# Altium project PCB_design_manufacture_bag_tag.PrjPcb
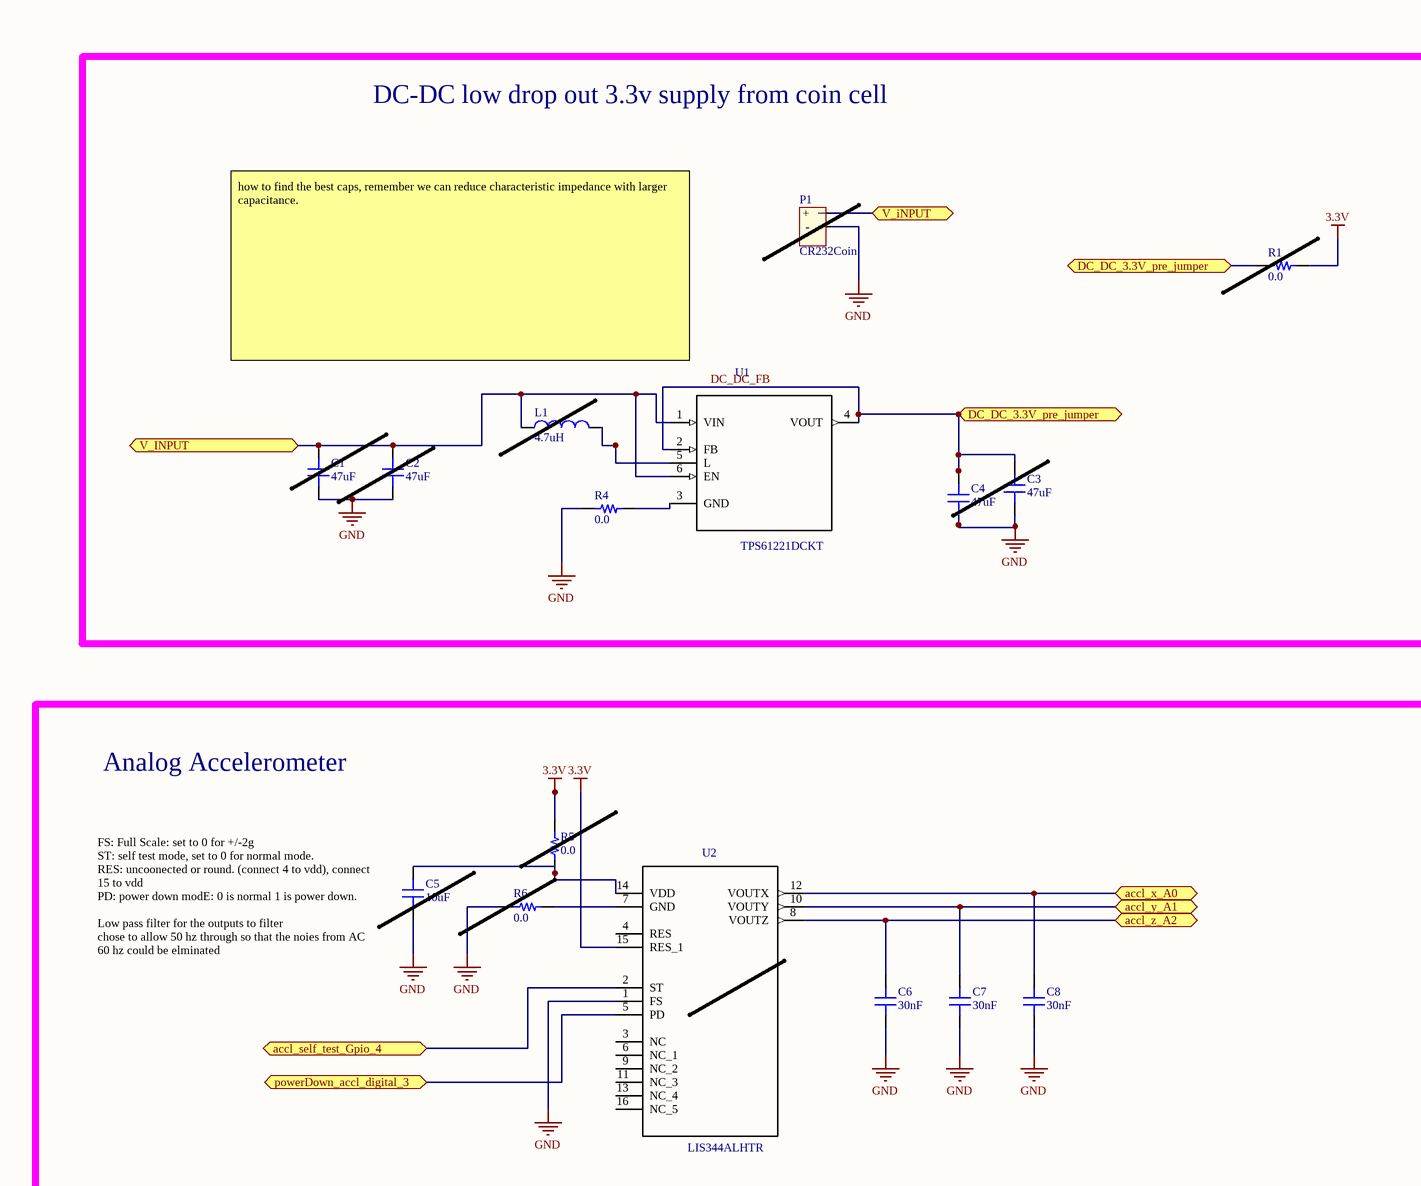
[diagram p0: bag_tag_v1.SchDoc, top left]
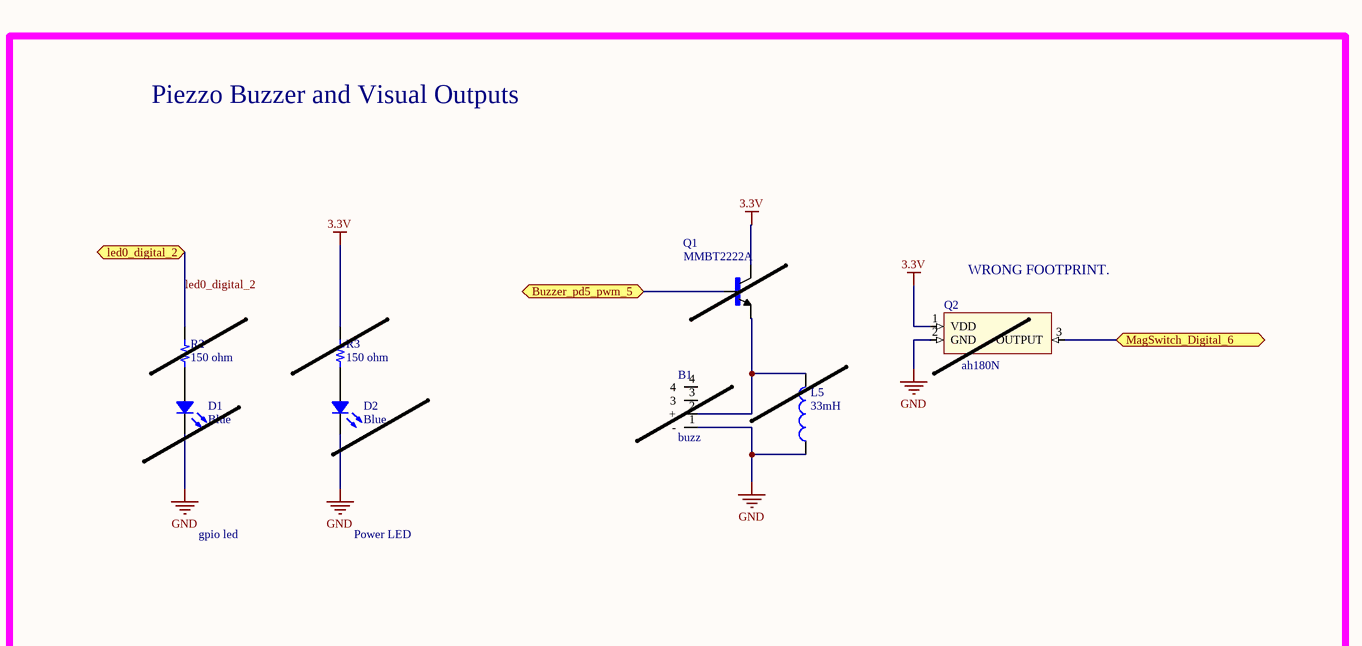
[diagram p1: bag_tag_v1.SchDoc, top right]
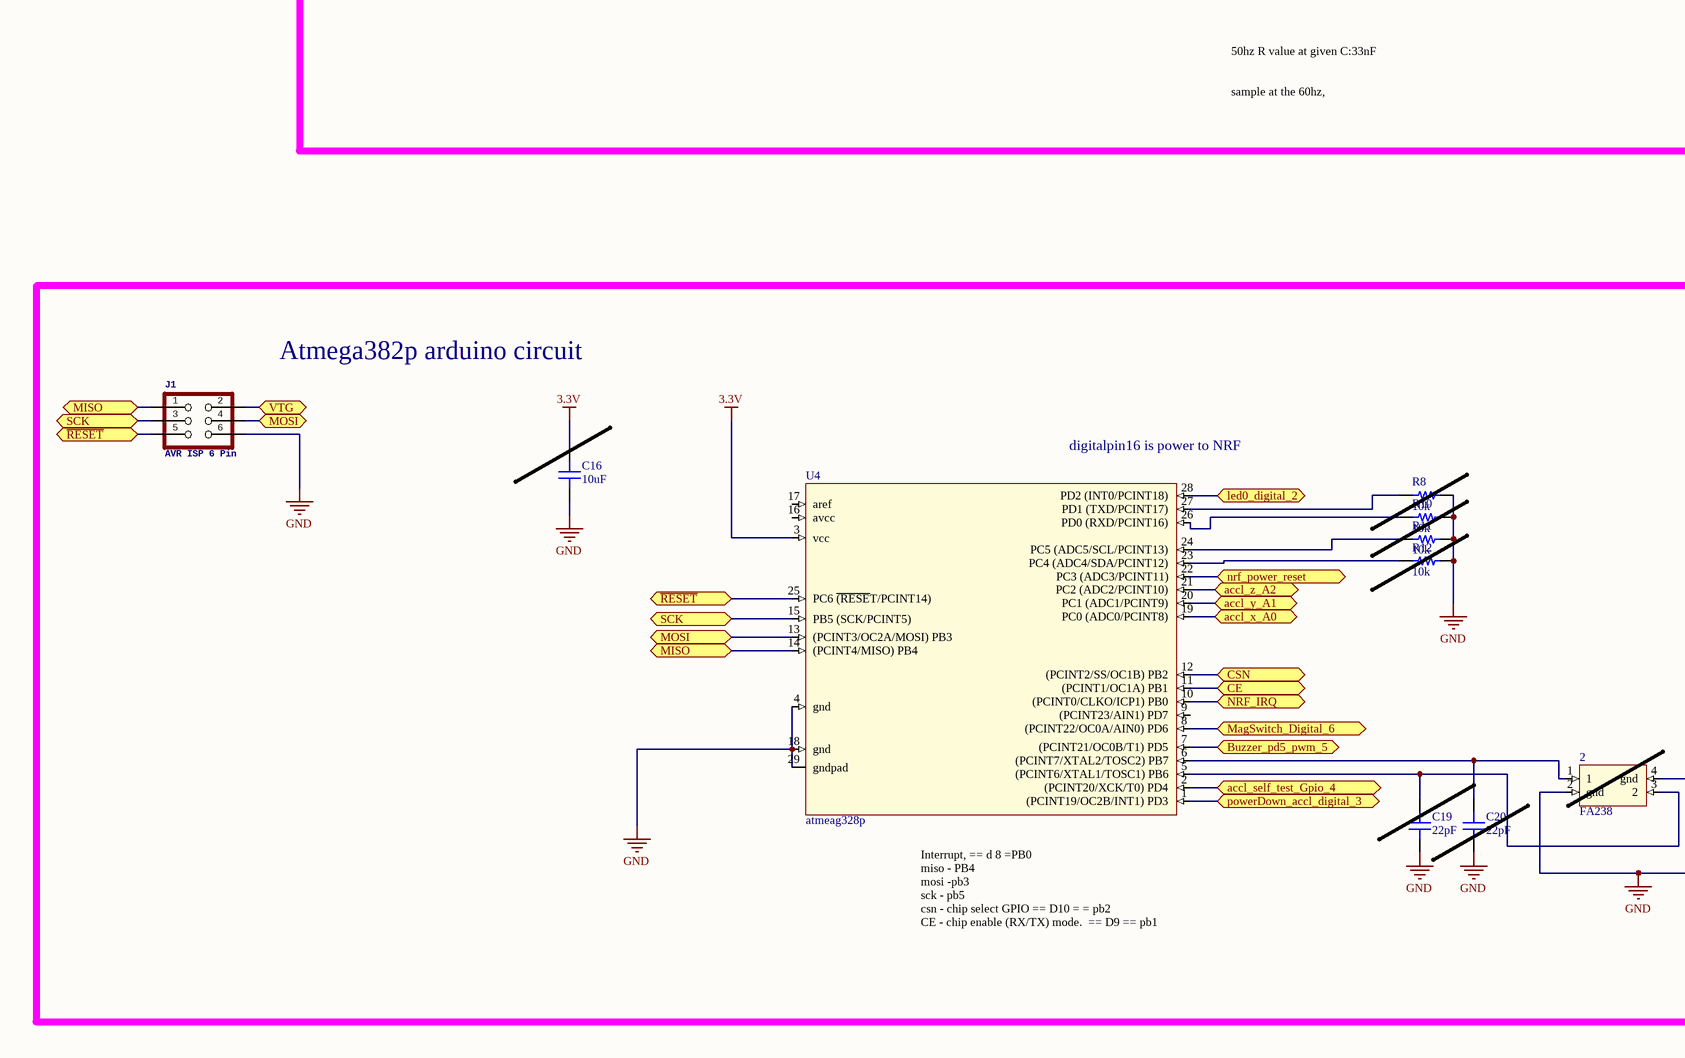
[diagram p2: bag_tag_v1.SchDoc, bottom left]
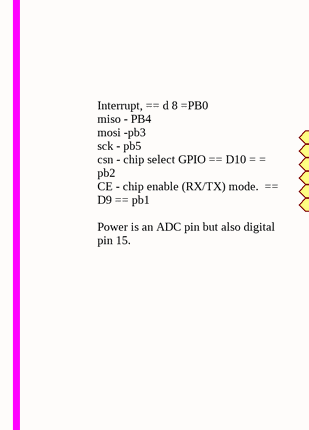
[diagram p3: bag_tag_v1.SchDoc, bottom middle]
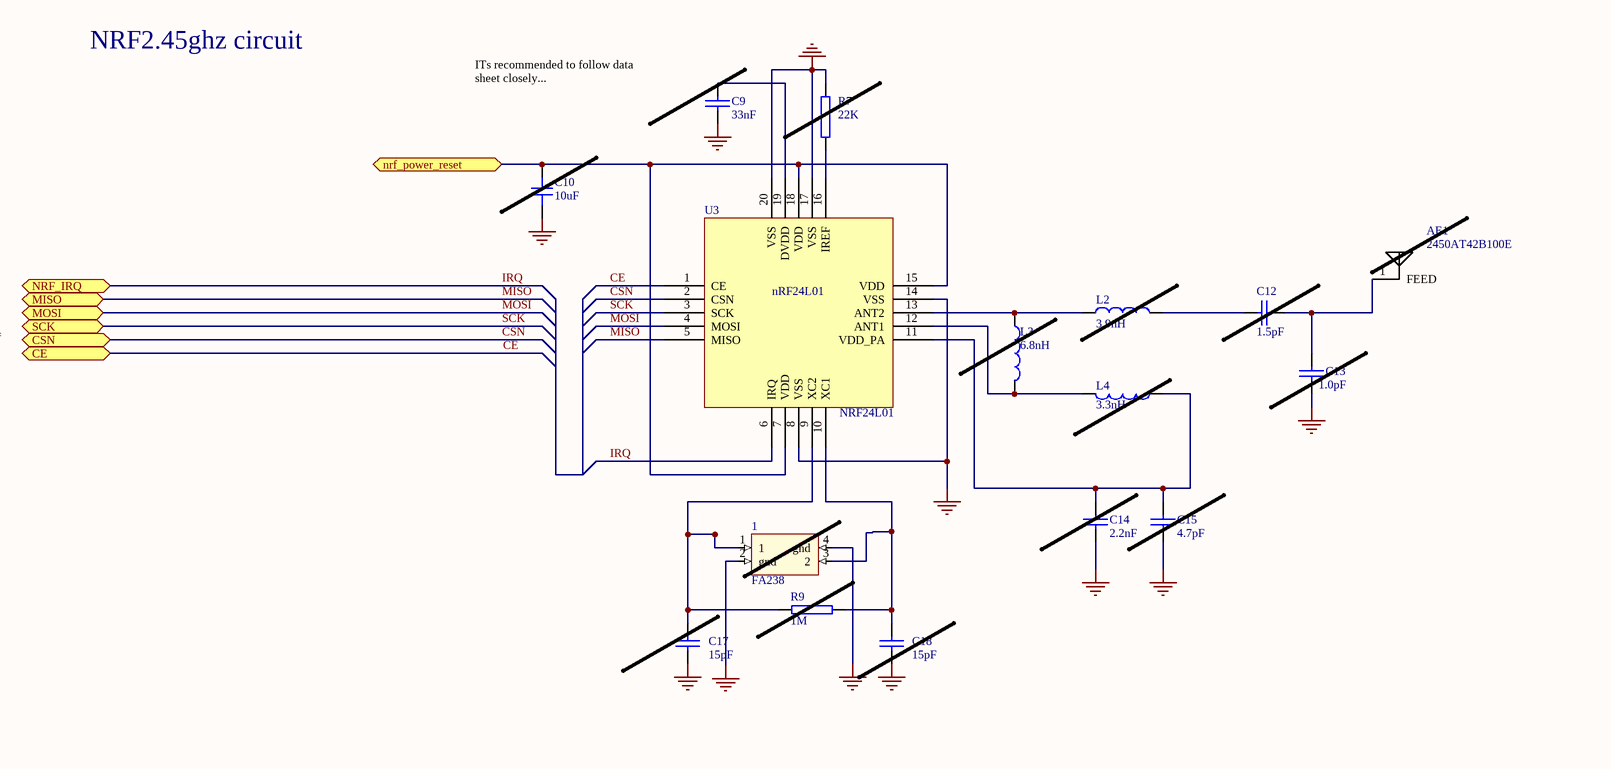
[diagram p4: bag_tag_v1.SchDoc, bottom right]
1 sheet, 50 parts. Net scope: flat (ports and power ports of the same name join across sheets).
Board file: bag_alamr_v1.PcbDoc

## Sheet bag_tag_v1.SchDoc
size E

### Parts
1  FA238  [OSCCC200X160X50]
2  FA238  [OSCCC200X160X50]
AE1  2450AT42B100E  [XCVR_2450AT42B100E]
B1  buzz  [5v_piezo_CUINC]
C1  47uF  [CAP 0603/1608]
C2  47uF  [CAP 0603/1608]
C3  47uF  [CAP 0603/1608]
C4  47uF  [CAP 0603/1608]
C5  10uF  [CAP 0805/2012]
C6  30nF  [CAP 0603/1608]
C7  30nF  [CAP 0603/1608]
C8  30nF  [CAP 0603/1608]
C9  33nF  [0402s]
C10  10uF  [CAP 0805/2012]
C12  1.5pF  [0402s]
C13  1.0pF  [0402s]
C14  2.2nF  [0402s]
C15  4.7pF  [0402s]
C16  10uF  [CAP 0805/2012]
C17  15pF  [0402s]
C18  15pF  [0402s]
C19  22pF  [CAP 0603/1608]
C20  22pF  [CAP 0603/1608]
D1  Blue  [LED 0603/1608 BLUE]
D2  Blue  [LED 0603/1608 BLUE]
J1  AVR ISP 6 Pin  [2X3-NS]
L1  4.7uH  [4_7]
L2  3.9nH  [0402s]
L3  6.8nH  [0402s]
L4  3.3nH  [0402s]
L5  33mH  [PCBComponent_1]
P1  CR232Coin  [Battery_clip]
Q1  MMBT2222A  [SOT23]
Q2  ah180N  [SOT95P240X110-3N]
R1  0.0  [RES 0402/1005]
R2  150 ohm  [RES 0402/1005]
R3  150 ohm  [RES 0402/1005]
R4  0.0  [RES 0402/1005]
R5  0.0  [RES 0402/1005]
R6  0.0  [RES 0402/1005]
R7  22K  [0402s]
R8  10k  [RES 0402/1005]
R9  1M  [0402s]
R10  10k  [RES 0402/1005]
R11  10k  [RES 0402/1005]
R12  10k  [RES 0402/1005]
U1  TPS61221DCKT  [SOT65P210X110-6N]
U2  LIS344ALHTR  [LGA16R65P4X4_400X400X160]
U3  NRF24L01  [QFN20L/5x5]
U4  atmeag328p  [yy]]

### Blocks framed on the sheet
Piezzo Buzzer and Visual Outputs: B1 D1 D2 L5 Q1 Q2 R2 R3
DC-DC low drop out 3.3v supply from coin cell: C1-C4 L1 P1 R1 R4 U1
Analog Accelerometer: C5-C8 R5 R6 U2
NRF2.45ghz circuit: 1 AE1 C9 C10 C12-C15 C17 C18 L2-L4 R7 R9 U3
Atmega382p arduino circuit: 2 C16 C19 C20 J1 R8 R10-R12 U4

### Ports
accl_self_test_Gpio_4, accl_x_A0, accl_y_A1, accl_z_A2, Buzzer_pd5_pwm_5, CE, CSN, DC_DC_3.3V_pre_jumper, led0_digital_2, MagSwitch_Digital_6, MISO, MOSI, NRF_IRQ, nrf_power_reset, powerDown_accl_digital_3, SCK, V_INPUT, V_iNPUT, VTG, ~{RESET}

### Nets
3.3V: C16.2 Q1.3(C) Q2.1(VDD) R1.1 R3.1 R5.2 U2.15(RES_1) U4.3(vcc)
GND: 1.2(gnd) 1.4(gnd) 2.2(gnd) 2.4(gnd) B1.1(-) C1.1 C2.1 C3.1 C4.1 C5.1 C6.1 C7.1 C8.1 C9.2 C10.1 C13.2 C14.1 C15.1 C16.1 C17.2 C18.1 C19.1 C20.1 D1.2 D2.2 J1.6 L5.1 P1.2(-) Q2.2(GND) R4.1 R6.1 R7.2 R8.2 R10.2 R11.2 R12.2 U2.1(FS) U3.8(VSS) U3.14(VSS) U3.17(VSS) U3.20(VSS) U4.4(gnd) U4.18(gnd) U4.29(gndpad)
CE: U3.1(CE) U4.11((PCINT1/OC1A)_PB1) ; port CE
CSN: U3.2(CSN) U4.12((PCINT2/SS/OC1B)_PB2) ; port CSN
DC_DC_FB: C3.2 C4.2 R1.2 U1.2(FB) U1.4(VOUT) ; port DC_DC_3.3V_pre_jumper
IRQ: U3.6(IRQ) U4.10((PCINT0/CLKO/ICP1)_PB0) ; port NRF_IRQ
led0_digital_2: R2.1 U4.28(PD2_(INT0/PCINT18)) ; port led0_digital_2
MISO: J1.1 U3.5(MISO) U4.14((PCINT4/MISO)_PB4) ; port MISO
MOSI: J1.4 U3.4(MOSI) U4.13((PCINT3/OC2A/MOSI)_PB3) ; port MOSI
SCK: J1.3 U3.3(SCK) U4.15(PB5_(SCK/PCINT5)) ; port SCK
Net1_1: 1.1 C17.1 R9.1 U3.9(XC2)
Net1_3: 1.3(2) C18.2 R9.2 U3.10(XC1)
Net2_1: 2.1 C20.2 U4.6((PCINT7/XTAL2/TOSC2)_PB7)
Net2_3: 2.3(2) C19.2 U4.5((PCINT6/XTAL1/TOSC1)_PB6)
NetAE1_1: AE1.1(FEED) C12.1 C13.1
NetB1_2: B1.2(+) L5.2 Q1.2(E)
NetC1_2: C1.2 C2.2 L1.1 P1.1(+) U1.1(VIN) U1.6(EN) ; port V_INPUT, port V_iNPUT
NetC5_2: C5.2 R5.1 U2.14(VDD)
NetC6_2: C6.2 U2.8(VOUTZ) U4.21(PC2_(ADC2/PCINT10)) ; port accl_z_A2
NetC7_2: C7.2 U2.10(VOUTY) U4.20(PC1_(ADC1/PCINT9)) ; port accl_y_A1
NetC8_2: C8.2 U2.12(VOUTX) U4.19(PC0_(ADC0/PCINT8)) ; port accl_x_A0
NetC9_1: C9.1 U3.19(DVDD)
NetC10_2: C10.2 U3.7(VDD) U3.15(VDD) U3.18(VDD) U4.22(PC3_(ADC3/PCINT11)) ; port nrf_power_reset
NetC12_2: C12.2 L2.2
NetC14_2: C14.2 C15.2 L4.1 U3.11(VDD_PA)
NetD1_1: D1.1 R2.2
NetD2_1: D2.1 R3.2
NetJ1_2: J1.2 ; port VTG
NetJ1_5: J1.5 U4.25(PC6_~{(RESE}T/PCINT14)) ; port ~{RESET}
NetL1_2: L1.2 U1.5(L)
NetL2_1: L2.1 L3.1 U3.13(ANT2)
NetL3_2: L3.2 L4.2 U3.12(ANT1)
NetQ1_1: Q1.1(B) U4.7((PCINT21/OC0B/T1)_PD5) ; port Buzzer_pd5_pwm_5
NetQ2_3: Q2.3(OUTPUT) U4.8((PCINT22/OC0A/AIN0)_PD6) ; port MagSwitch_Digital_6
NetR4_2: R4.2 U1.3(GND)
NetR6_2: R6.2 U2.7(GND)
NetR7_1: R7.1 U3.16(IREF)
NetR8_1: R8.1 U4.27(PD1_(TXD/PCINT17))
NetR10_1: R10.1 U4.26(PD0_(RXD/PCINT16))
NetR11_1: R11.1 U4.24(PC5_(ADC5/SCL/PCINT13))
NetR12_1: R12.1 U4.23(PC4_(ADC4/SDA/PCINT12))
NetU2_2: U2.2(ST) U4.2((PCINT20/XCK/T0)_PD4) ; port accl_self_test_Gpio_4
NetU2_5: U2.5(PD) U4.1((PCINT19/OC2B/INT1)_PD3) ; port powerDown_accl_digital_3

Not connected (* = marked no-connect by the designer): B1 3 4; P1 3(+); U2 3(NC) 4(RES) 6(NC_1) 9(NC_2) 11(NC_3) 13(NC_4) 16(NC_5); U4 9((PCINT23/AIN1)_PD7) 16(avcc) 17(aref)

### Notes on the sheet
- (near Q2) WRONG FOOTPRINT.
- how to find the best caps, remember we can reduce characteristic impedance with larger capacitance.
- gpio led
- Power LED
- (near C5) FS: Full Scale: set to 0 for +/-2g
  ST: self test mode, set to 0 for normal mode.
  RES: uncoonected or round. (connect 4 to vdd), connect 15 to vdd
  PD: power down modE: 0 is normal 1 is power down.
  Low pass filter for the outputs to filter
  chose to allow 50 hz through so that the noies from AC 60 hz could be elminated
- ITs recommended to follow data sheet closely...
  cut off frequency for the gpio to the cap,
  get cap value.
- 50hz R value at given C:33nF
  sample at the 60hz,
- Interrupt, == d 8 =PB0
  miso - PB4
  mosi -pb3
  sck - pb5
  csn - chip select GPIO == D10 = = pb2
  CE - chip enable (RX/TX) mode.  == D9 == pb1
  Power is an ADC pin but also digital pin 15.
- (near U4) digitalpin16 is power to NRF
- (near U4) Interrupt, == d 8 =PB0
  miso - PB4
  mosi -pb3
  sck - pb5
  csn - chip select GPIO == D10 = = pb2
  CE - chip enable (RX/TX) mode.  == D9 == pb1
- (in symbol NRF24L01) nRF24L01

### Library data of the parts
1 2 = FA238: FA238 4 pin can crstyal
AE1 = 2450AT42B100E: Antenna Chip 2.4ghz; MF: Johanson; Package: None; MP: 2450AT42B100E; Availability: Good; Price: 0.45 USD; SnapEDA_Link: https://www.snapeda.com/symbols-footprints/2450AT42B100E/Johanson/view-part/?ref=snap; Value: *
B1 = cmt-8540s-smt: 5v piezo smd 8.5mm square
C1-C4 C6-C8 = C1608X7R1E104K080AA: CAP CER 0.1UF 25V X7R 0603; Manufacturer: TDK Corporation; TemperatureRange: -55C ~ 125C; Tolerance: 10%; Part Number: C1608X7R1E104K080AA; PartId: 4029; Supplier 1: Digi-Key; Supplier Part Number 1: 445-1316-1-ND; ComponentLink1Description: Datasheet; ComponentLink1URL: https://product.tdk.com/info/en/catalog/datasheets/mlcc_commercial_general_en.pdf; ComponentLink2Description: Digi-Key listing; ComponentLink2URL: http://digikey.com/product-detail/en/C1608X7R1E104K080AA/445-1316-1-ND/567697; TemperatureCoefficient: X7R; Voltage: 25V; Price: 0.14; Type: -; Device Package: 0603 (1608 Metric)
  C1-C4: Value: 47uF
  C6-C8: Value: 30nF
C5 C10 C16 = C2012X7R0J106K125AB: CAP CER 10UF 6.3V X7R 0805; Value: 10uF; Part Number: C2012X7R0J106K125AB
C9 C12-C15 C17 C18 = CAP: Part Field 1: 0402
C19 C20 = C1608C0G1H220J080AA: CAP CER 22PF 50V C0G 0603; Manufacturer: TDK Corporation; TemperatureRange: -55C ~ 125C; TemperatureCoefficient: C0G, NP0; Tolerance: 5%; Value: 22pF; Part Number: C1608C0G1H220J080AA; PartId: 4031; Supplier 1: Digi-Key; Supplier Part Number 1: 445-1273-1-ND; ComponentLink1Description: Datasheet; ComponentLink1URL: https://product.tdk.com/info/en/catalog/datasheets/mlcc_commercial_general_en.pdf; ComponentLink2Description: Digi-Key listing; ComponentLink2URL: http://digikey.com/product-detail/en/C1608C0G1H220J080AA/445-1273-1-ND/567670; Voltage: 50V; Price: 0.14; Type: -; Device Package: 0603 (1608 Metric)
D1 D2 = HSMR-C190: LED BLUE DIFFUSED 0603 SMD; Manufacturer: Avago Technologies US Inc.; Value: Green; Type: Surface Mount; Millicandela: 55mcd; Voltage Forward: 3.4V; Current (Test): 20mA; Viewing Angle: 155; Part Number: HSMR-C190; PartId: 7058; Supplier 1: Digi-Key; Supplier Part Number 1: 516-2502-2-ND; ComponentLink1Description: Datasheet; ComponentLink1URL: http://www.avagotech.com/docs/AV02-0977EN; ComponentLink2Description: Digi-Key Listing; ComponentLink2URL: http://www.digikey.ca/product-detail/en/HSMR-C190/516-2502-2-ND/1235444; Price: 0.3614; Device Package: 0603 (1608 Metric); Colour: Blue; Lens Transparency: Diffused
J1 = AVR_SPI_PROG_3X2NS
L1 = 4.7uH: 4.7 uH inductor pulse PA4335.472NLT    arrow
L2-L4 = INDUCTOR1: Part Field 1: 0402
L5 = Component_1kmp2200rm: 33mH inductor for piezo; Value: 33mH
P1 = S8201R: coin cell for cr232 and uses smd
Q1 = MMBT2222A: TRANS NPN 40V 1A SOT-23; MF: ON Semiconductor; Availability: Good; Price: 0.06 USD; MP: MMBT2222A; Package: SOT-23 ON Semiconductor; Value: *
Q2 = ah180N: Hall effect switch digikey, sc59
R1 R4-R6 = RC0402JR-070RL: RES SMD 0.0OHM JUMPER 1/16W 0402; Manufacturer: Yageo; TemperatureRange: -55C ~ 155C; PowerRating: 0.063W, 1/16W; Value: 0.0; Part Number: RC0402JR-070RL; PartId: 16128; Supplier 1: Digi-Key; Supplier Part Number 1: 311-0.0JRTR-ND; ComponentLink1Description: Datasheet; ComponentLink1URL: http://www.yageo.com/documents/recent/PYu-RC_Group_51_RoHS_L_04.pdf; ComponentLink2Description: Digi-Key Listing; ComponentLink2URL: https://www.digikey.com/product-detail/en/yageo/RC0402JR-070RL/311-0.0JRTR-ND/726406; Tolerance: Jumper; Price: 0.0019; Device Package: 0402 (1005 Metric)
R2 R3 R8 R10-R12 = ERJ-2RKF1002X: RES SMD 10K OHM 1% 1/10W 0402; Manufacturer: Panasonic Electronic Components; TemperatureRange: -55C ~ 155C; TemperatureCoefficient: 100ppm/C; PowerRating: 0.1W, 1/10W; Part Number: ERJ-2RKF1002X; PartId: 1; Supplier 1: Digi-Key; Supplier Part Number 1: P10.0KLTR-ND; ComponentLink1Description: Datasheet; ComponentLink1URL: http://industrial.panasonic.com/www-cgi/jvcr13pz.cgi?E+PZ+3+AOA0002+ERJ2RKF1002X+7+WW; ComponentLink2Description: Digikey listing; ComponentLink2URL: http://digikey.com/product-detail/en/ERJ-2RKF1002X/P10.0KLTR-ND/192073; Tolerance: 1%; Price: 0.0043; Type: Thick Film; Device Package: 0402 (1005 Metric)
  R2 R3: Value: 150 ohm
  R8 R10-R12: Value: 10k
R7 R9 = RES2: Part Field 1: 0402
U1 = TPS61221DCKT: Tiny Low Input Voltage Boost Converter 6-SC70 -40 to 85; MF: Texas Instruments; MP: TPS61221DCKT; Package: SC-70-6 Texas Instruments; Availability: Good; Price: 0.97 USD; Value: *
U2 = LIS344ALHTR: MEMS inertial sensor high performance 3-axis Â±2/ Â±6g ultracompact linear accelerometer; MF: STMicroelectronics; SnapEDA_Link: https://www.snapeda.com/symbols-footprints/LIS344ALHTR/STMicroelectronics/view-part/?ref=snap; Availability: Good; MP: LIS344ALHTR; Price: 2.81 USD; Package: LGA-16 STMicroelectronics; Value: *
U3 = NRF24L01: Part Field 1: 0603
U4 = 328p_28QFN: 28 pin qfn, or mlf 28 pin compatible with uno